# Altium schematic sheet TFT_Ticketing_Master.SchDoc
size A4; Author: Mario Dos Santos; Organization: ETML-ES; Address1: Avenue Recordon 1; Address2: 1004 Lausanne; Address3: Switzerland; Revision: C; SheetNumber: 4; SheetTotal: 6
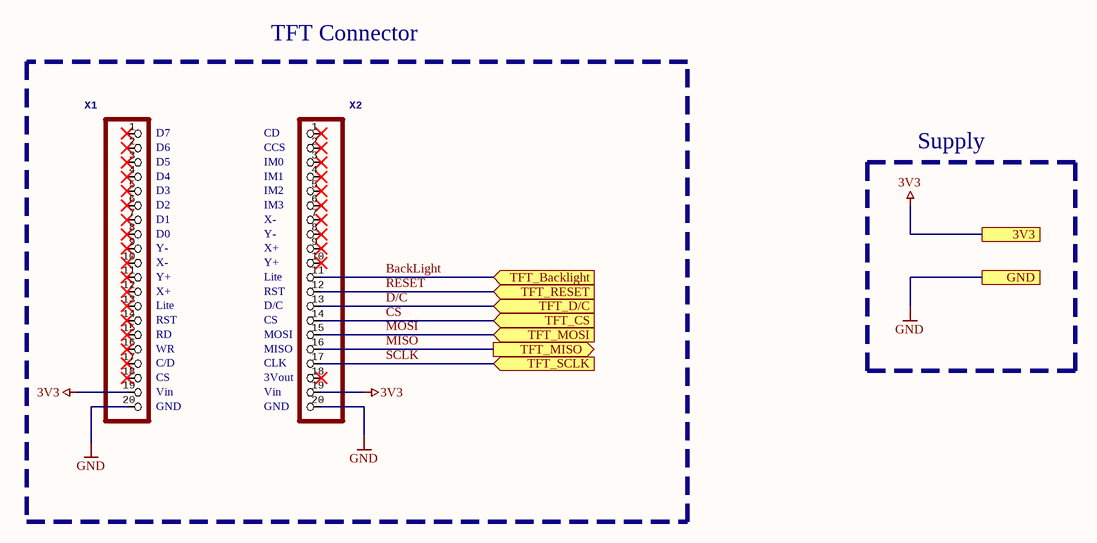
[diagram p0: TFT_Ticketing_Master.SchDoc]

## Parts
X1  HEADER-1X20ROUND  [HDR1X20]  (value not drawn)
X2  HEADER-1X20ROUND  [HDR1X20]  (value not drawn)

## Blocks framed on the sheet
TFT Connector: X1 X2

## Ports
3V3, GND, TFT_Backlight (in), TFT_CS (in), TFT_D/C (in), TFT_MISO (out), TFT_MOSI (in), TFT_RESET (in), TFT_SCLK (in)

## Nets
3V3: X1.19 X2.19 ; port 3V3
GND: X1.20 X2.20 ; port GND
BackLight: X2.11 ; port TFT_Backlight
CS: X2.14 ; port TFT_CS
D/C: X2.13 ; port TFT_D/C
MISO: X2.16 ; port TFT_MISO
MOSI: X2.15 ; port TFT_MOSI
RESET: X2.12 ; port TFT_RESET
SCLK: X2.17 ; port TFT_SCLK

Not connected (* = marked no-connect by the designer): X1 1* 2* 3* 4* 5* 6* 7* 8* 9* 10* 11* 12* 13* 14* 15* 16* 17* 18*; X2 1* 2* 3* 4* 5* 6* 7* 8* 9* 10* 18*

## Notes on the sheet
- (near X1) D7
- (near X1) D6
- (near X2) CD
- (near X2) CCS
- Supply
- (near X1) D5
- (near X1) D4
- (near X1) D3
- (near X1) D2
- (near X1) D1
- (near X1) D0
- (near X2) IM0
- (near X2) IM1
- (near X2) IM2
- (near X2) IM3
- (near X2) X-
- (near X2) Y-
- (near X1) Y-
- (near X1) X-
- (near X1) Y+
- (near X1) X+
- (near X2) X+
- (near X2) Y+
- (near X2) Lite
- (near X2) RST
- (near X1) Lite
- (near X1) RST
- (near X1) RD
- (near X1) WR
- (near X1) C/D
- (near X1) CS
- (near X2) D/C
- (near X2) CS
- (near X2) MOSI
- (near X2) MISO
- (near X2) CLK
- (near X2) 3Vout
- (near X1) Vin
- (near X1) GND
- (near X2) Vin
- (near X2) GND
- Fichier :
- a
- Date :
- Heure :
- Version :
- Auteur :
- Modif.
- b
- c
- d
- Projet :
- No :
- Nb feuilles
- Feuille n°
- Chemin :

## Library data of the parts
X1 = HEADER-1X20ROUND: Con_TFT_Gauche; Value: HEADER-1X20ROUND; Supplier: Digi-Key
X2 = HEADER-1X20ROUND: Con_TFT_Droite; Value: HEADER-1X20ROUND; Supplier: Digi-Key